# Altium schematic sheet ADC-Q CHANNEL GAIN CONTROL.SchDoc: <SPECIFIC SHEET FUNCTION>
size A3; Date: DO NOT USE, RATHER USE PROJ OPTIONS; DrawnBy: DO NOT USE, RATHER USE PROJ OPTIONS; Engineer: DO NOT USE, RATHER USE PROJ OPTIONS; Organization: DO NOT USE, RATHER USE PROJ OPTIONS; DocumentNumber: 11; Revision: DO NOT USE, RATHER USE PROJ OPTIONS; SheetNumber: 11; SheetTotal: 12; SCH_Sheet_Filename: ADC-Q CHANNEL GAIN CONTROL.SchDoc; CurrentTime: DO NOT USE, RATHER USE PROJ OPTIONS; Time: DO NOT USE, RATHER USE PROJ OPTIONS; DocumentFullPathAndName: DO NOT USE, RATHER USE PROJ OPTIONS; DocumentName: DO NOT USE, RATHER USE PROJ OPTIONS; ModifiedDate: DO NOT USE, RATHER USE PROJ OPTIONS; ImagePath: DO NOT USE, RATHER USE PROJ OPTIONS
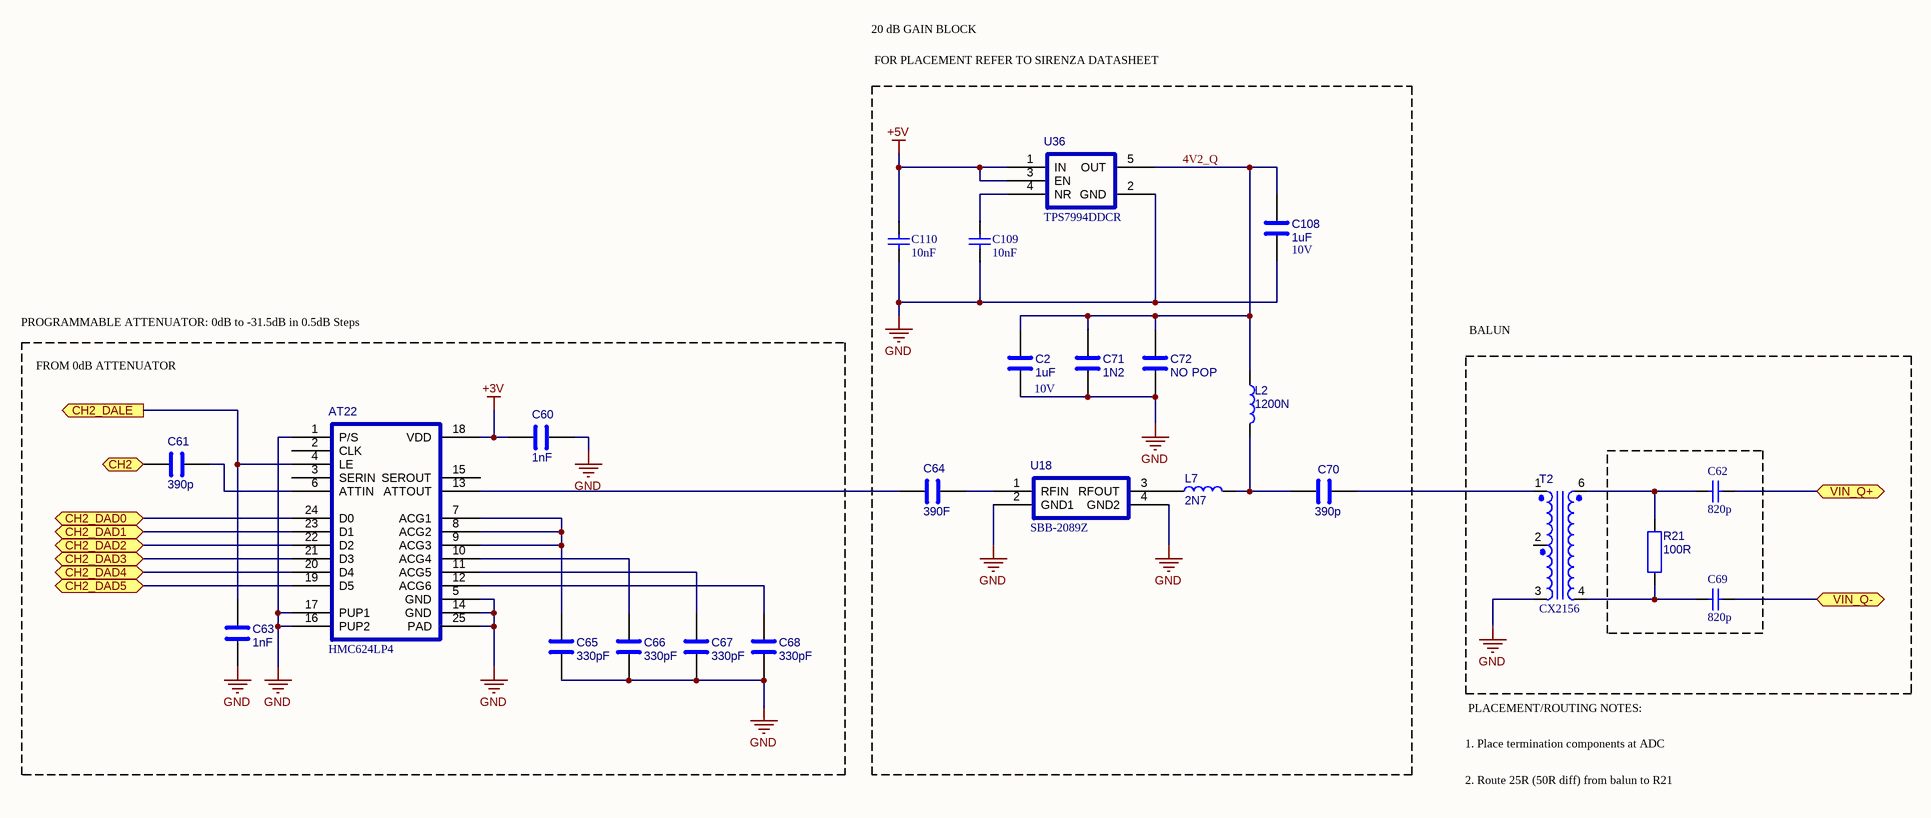
[diagram p0: ADC-Q CHANNEL GAIN CONTROL.SchDoc]

## Parts
AT22  HMC624LP4  [QFN50P400X400X100-25USR]
C2  value 1uF  Voltage: 10V  [CAPC1632X80USR]  (hidden comment: *)
C60  value 1nF  [0603]  (hidden comment: Footprint ???)
C61  value 390p  [CAPC1005X55N]  (hidden comment: *)
C62  value 820p  [CAPC1005X55N]  (hidden comment: Capacitor 0402 SMD)
C63  value 1nF  [0603]  (hidden comment: *)
C64  value 390F  [CAPC1005X55N]  (hidden comment: *)
C65  value 330pF  [0603]  (hidden comment: *)
C66  value 330pF  [0603]  (hidden comment: *)
C67  value 330pF  [0603]  (hidden comment: *)
C68  value 330pF  [0603]  (hidden comment: *)
C69  value 820p  [CAPC1005X55N]  (hidden comment: Capacitor 0402 SMD)
C70  value 390p  [CAPC1005X55N]  (hidden comment: Footprint ???)
C71  value 1N2  [CAPC1005X55N]  (hidden comment: *)
C72  value NO POP  [CAPC1005X55N]  (hidden comment: *)
C108  value 1uF  Voltage: 10V  [CAPC1632X80USR]  (hidden comment: Footprint ???)
C109  value 10nF  [CAPC1005X55N]  (hidden comment: Capacitor 0402 SMD)
C110  value 10nF  [CAPC1005X55N]  (hidden comment: Capacitor 0402 SMD)
L2  value 1200N  [INDM2520X160N]
L7  value 2N7  [INDC1005X60N]
R21  100R  [RESC1005X40N]
T2  CX2156  [PULSE_KAYAK]
U18  SBB-2089Z  [SIRENZA_SOT89]
U36  TPS7994DDCR  [SOT95P280X110-5USR]

## Ports
CH2 (out), CH2_DAD0, CH2_DAD1, CH2_DAD2, CH2_DAD3, CH2_DAD4, CH2_DAD5, CH2_DALE (out), VIN_Q+, VIN_Q-

## Nets
+3V: AT22.18(VDD) C60.1
+5V: C110.1 U36.1(IN) U36.3(EN)
GND: AT22.1(P/S) AT22.5(GND) AT22.14(GND) AT22.16(PUP2) AT22.17(PUP1) AT22.25(PAD) C2.2 C60.2 C63.2 C65.2 C66.2 C67.2 C68.2 C71.2 C72.2 C108.2 C109.2 C110.2 T2.3 U18.2(GND1) U18.4(GND2) U36.2(GND)
4V2_Q: C2.1 C71.1 C72.1 C108.1 L2.1 U36.5(OUT)
CH2: C61.1 ; port CH2
CH2_DAD0: AT22.24(D0) ; port CH2_DAD0
CH2_DAD1: AT22.23(D1) ; port CH2_DAD1
CH2_DAD2: AT22.22(D2) ; port CH2_DAD2
CH2_DAD3: AT22.21(D3) ; port CH2_DAD3
CH2_DAD4: AT22.20(D4) ; port CH2_DAD4
CH2_DAD5: AT22.19(D5) ; port CH2_DAD5
CH2_DALE: AT22.4(LE) C63.1 ; port CH2_DALE
VIN_Q+: C62.2 ; port VIN_Q+
VIN_Q-: C69.2 ; port VIN_Q-
NetAT22_6: AT22.6(ATTIN) C61.2
NetAT22_7: AT22.7(ACG1) AT22.8(ACG2) AT22.9(ACG3) C65.1
NetAT22_10: AT22.10(ACG4) C66.1
NetAT22_11: AT22.11(ACG5) C67.1
NetAT22_12: AT22.12(ACG6) C68.1
NetAT22_13: AT22.13(ATTOUT) C64.1
NetC62_1: C62.1 R21.1 T2.6
NetC64_2: C64.2 U18.1(RFIN)
NetC69_1: C69.1 R21.2 T2.4
NetC70_1: C70.1 L2.2 L7.2
NetC70_2: C70.2 T2.1
NetC109_1: C109.1 U36.4(NR)
NetL7_1: L7.1 U18.3(RFOUT)

Not connected (* = marked no-connect by the designer): AT22 2(CLK) 3(SERIN) 15(SEROUT); T2 2

## Notes on the sheet
- 20 dB GAIN BLOCK
- FOR PLACEMENT REFER TO SIRENZA DATASHEET
- PROGRAMMABLE ATTENUATOR: 0dB to -31.5dB in 0.5dB Steps
- FROM 0dB ATTENUATOR
- BALUN
- PLACEMENT/ROUTING NOTES:
- 1. Place termination components at ADC
- 2. Route 25R (50R diff) from balun to R21
- 2009   THIS DOCUMENT IS THE PROPERTY OF THE OWNER, AND MAY NOT BE COPIED OR USED FOR ANY PURPOSE OTHER THAN THAT FOR WHICH IT IS SUPPLIED WITHOUT PERMISSION IN WRITING FROM THE OWNER.
- C
- DATESTAMP OF THIS PRINT
- DRAWN BY:
- DOCUMENT NUMBER:
- SCHEMATIC FILENAME:
- PCB FILENAME:
- ENGINEER:
- APPROVED:
- CIRCUIT DIAGRAM
- DATE
- SHEET
- REVISION
- OF

## Library data of the parts
AT22 = HMC624LP4: Broadband 6-bit IC Digital Attenuator; Manufacturer: Hittite; Created_By: IN; Checked_By: NN; Manufacturer_PN: HMC624LP4; Checked_Date: NN-08-2009; HelpURL: X:\Datasheets\By_Manufacturer\Hittite\hmc624lp4.pdf; ComponentLink1Description: Footprint Detail; ComponentLink1URL: X:\Datasheets\By_Manufacturer\Hittite\hmc624lp4.pdf#page=6; ComponentLink2Description: Application Note; ComponentLink2URL: *; ComponentLink3Description: Layout Guidelines; ComponentLink3URL: X:\Datasheets\By_Manufacturer\Hittite\hmc624lp4.pdf#page=9; ComponentLink4Description: Technology Reference; ComponentLink4URL: *; Supplier1: *; Supplier2: *; Unit_Cost: *; MOQ: *; Leadtime: *; Inventory_Stock: *; Tolerance: *; Wattage: *; Voltage: *; Package: QFN24; ComponentLink5Description: Production Detail; ComponentLink5URL: *; Note: *; Stock Code: *
C2 C60 C61 C63-C68 C70-C72 C108 = CAP-0603: CAP SMD 0603; Manufacturer: *; Manufacturer_PN: *; Created_By: *; Checked_By: *; Checked_Date: *; HelpURL: *; ComponentLink1Description: Footprint Detail; ComponentLink1URL: *; ComponentLink2Description: Application Note; ComponentLink2URL: *; ComponentLink3Description: Layout Guidelines; ComponentLink3URL: *; ComponentLink4Description: Technology Reference; ComponentLink4URL: *; Supplier1: *; Supplier2: *; Unit_Cost: *; MOQ: *; Leadtime: *; Inventory_Stock: *; Tolerance: *; Wattage: *; Package: 0603; ComponentLink5Description: Production Detail; ComponentLink5URL: *; Note: *; Stock Code: *
  C60 C61 C63-C68 C70-C72: Voltage: *
C62 C69 C109 C110 = cap0402: Created_By: EDA-ASA; Checked_By: *; Checked_Date: *; HelpURL: *; Supplier1: *; Supplier2: *; Unit_Cost: *; MOQ: *; Leadtime: *; Inventory_Stock: *; Tolerance: *; Wattage: *; Package: 0402; ComponentLinked1Description: *; ComponentLinked1URL: *; ComponentLinked2Description: *; ComponentLinked2URL: *; ComponentLinked3Description: *; ComponentLinked3URL: *; ComponentLinked4Description: *; ComponentLinked4URL: *
L2 L7 = CHOKE: Created_By: EDA-ASA; Checked_By: *; Checked_Date: *; HelpURL: *; ComponentLinked1Description: *; ComponentLinked1URL: *; ComponentLinked2Description: *; ComponentLinked2URL: *; ComponentLinked3Description: *; ComponentLinked3URL: *; ComponentLinked4Description: *; ComponentLinked4URL: *; Supplier1: *; Supplier2: *; Unit_Cost: *; MOQ: *; Leadtime: *; Inventory_Stock: *; Tolerance: *; Wattage: *
R21 = RES-0805: RESISTOR SMD 0805; Checked_By: NN; Manufacturer: *; Manufacturer_PN: *; Created_By: *; Checked_Date: 5-08-2009; HelpURL: *; ComponentLink1Description: Footprint Detail; ComponentLink1URL: *; ComponentLink2Description: Application Note; ComponentLink2URL: *; ComponentLink3Description: Layout Guidelines; ComponentLink3URL: *; ComponentLink4Description: Technology Reference; ComponentLink4URL: *; Supplier1: *; Supplier2: *; Unit_Cost: *; MOQ: *; Leadtime: *; Inventory_Stock: *; Tolerance: *; Wattage: *; Voltage: *; Package: 0805; ComponentLink5Description: Production Detail; ComponentLink5URL: *; Note: *; Stock Code: *; Value: 100R
T2 = CX2156: TRANSFORMER WIDEBAND RF APPLICATION; Voltage: ???; Manufacturer: *; Created_By: *; Checked_By: *; Checked_Date: *; HelpURL: *; ComponentLink1Description: TRANSFORMER WIDEBAND RF APPLICATION; ComponentLink1URL: *; ComponentLink2Description: Application Note; ComponentLink2URL: *; ComponentLink3Description: Layout Guidelines; ComponentLink3URL: *; ComponentLink4Description: Technology Reference; ComponentLink4URL: *; Supplier1: *; Supplier2: *; Unit_Cost: *; MOQ: *; Leadtime: *; Inventory_Stock: *; Tolerance: *; Wattage: *; Package: *; ComponentLink5Description: Production Detail; ComponentLink5URL: *; Note: *; Stock Code: *; Manufacturer_PN: CX2156
U18 = SBB-2089Z: High performance InaGaP HBT MMIC amplfier; Manufacturer: Sirenza Micodevices; Created_By: IN; Manufacturer_PN: SBB-2089Z; Checked_By: *; Checked_Date: *; HelpURL: X:\Datasheets\By_Manufacturer\Sirenza\SBB-2089(Z)_Datasheet.pdf; ComponentLink1Description: Footprint Detail; ComponentLink1URL: X:\Datasheets\By_Manufacturer\Sirenza\SBB-2089(Z)_Datasheet.pdf#Page=5; ComponentLink2Description: Application Note; ComponentLink2URL: *; ComponentLink3Description: Layout Guidelines; ComponentLink3URL: *; ComponentLink4Description: Technology Reference; ComponentLink4URL: *; Supplier1: *; Supplier2: *; Unit_Cost: *; MOQ: *; Leadtime: *; Inventory_Stock: *; Tolerance: *; Wattage: *; Voltage: *; Package: *; ComponentLink5Description: Production Detail; ComponentLink5URL: *; Note: *; Stock Code: *
U36 = TPS7994DDCR: Low Quiescent Current, Ultra-Low Noise Dropout Linear Regulator; Manufacturer: TI; Created_By: IN; Manufacturer_PN: TPS7994DDCR; Checked_By: *; Checked_Date: *; HelpURL: X:\Datacheets\By_Manufacture\TI\296-17776-2.pdf; ComponentLink1Description: Footprint Detail; ComponentLink1URL: *; ComponentLink2Description: Application Note; ComponentLink2URL: *; ComponentLink3Description: Layout Guidelines; ComponentLink3URL: *; ComponentLink4Description: Technology Reference; ComponentLink4URL: *; Supplier1: *; Supplier2: *; Unit_Cost: *; MOQ: *; Leadtime: *; Inventory_Stock: *; Tolerance: *; Wattage: *; Voltage: *; Package: *; ComponentLink5Description: Production Detail; ComponentLink5URL: *; Note: *; Stock Code: *